# Altium project accessoryidk.PrjPcb
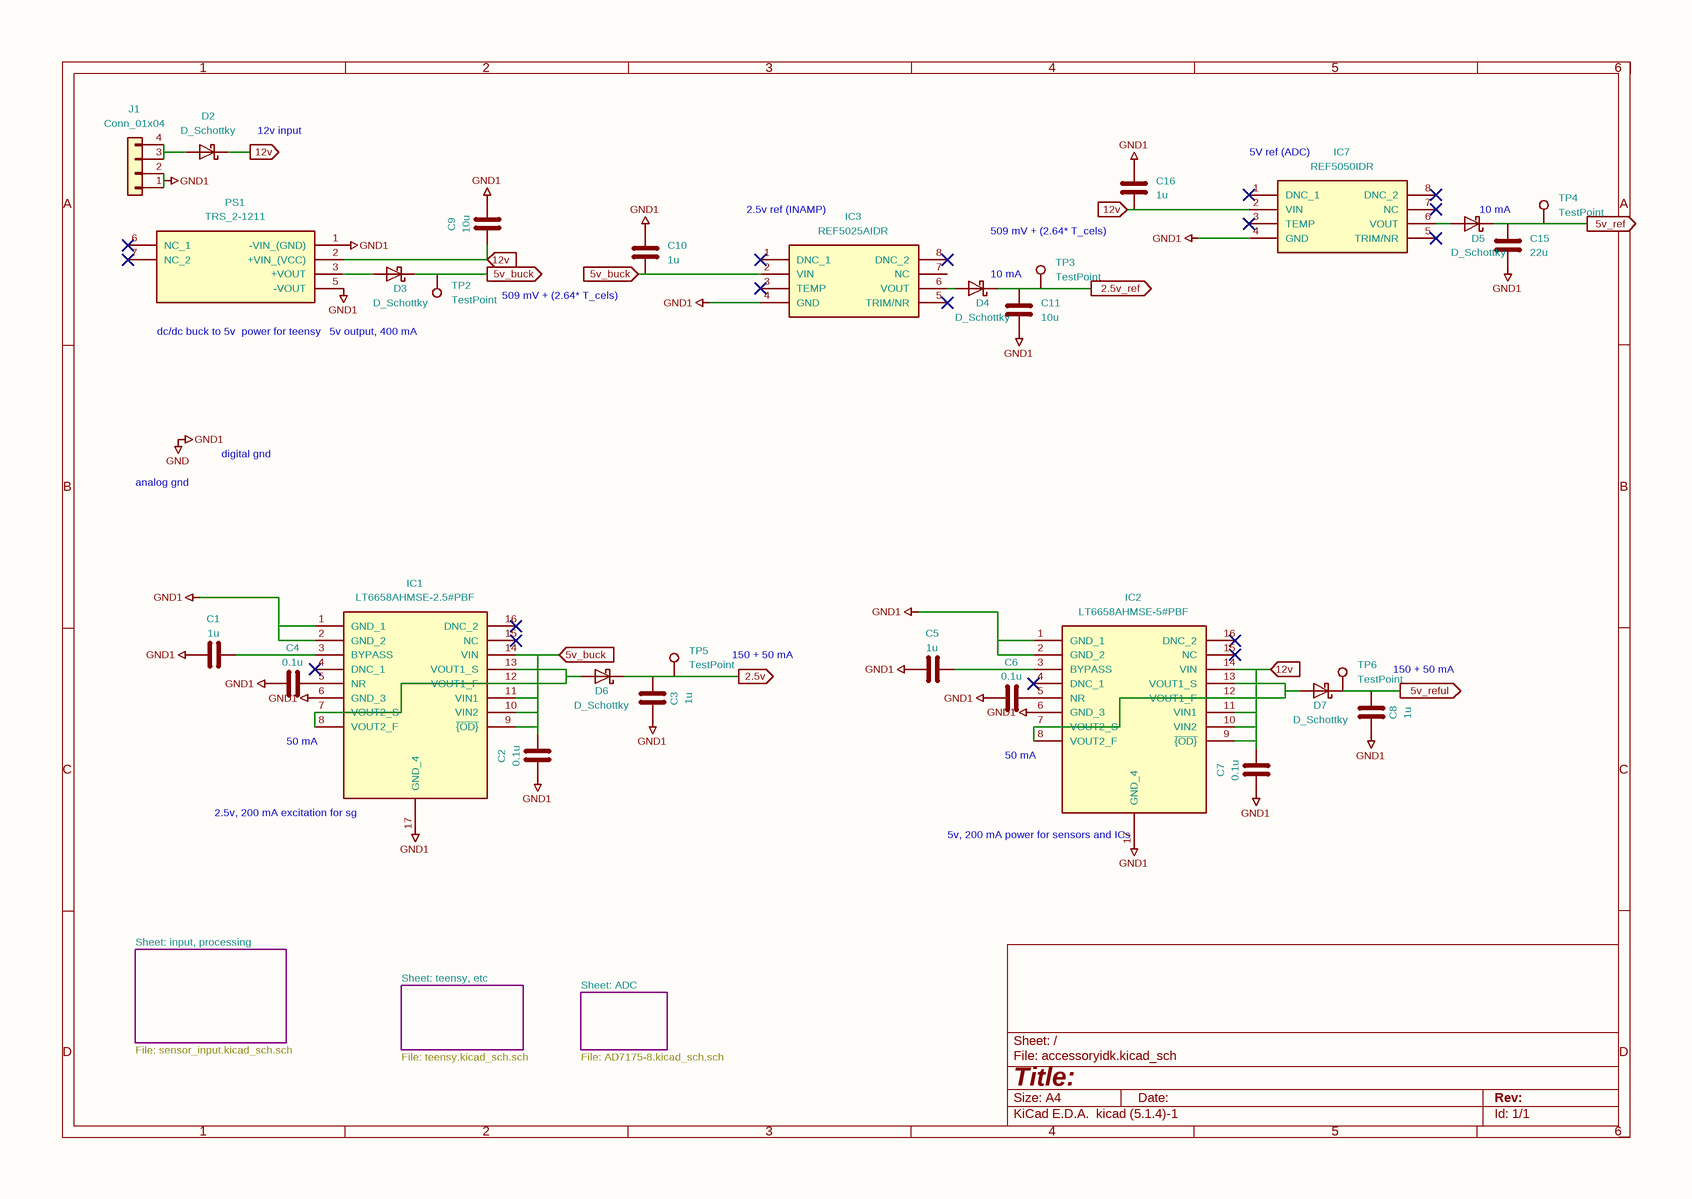
[diagram p0: accessoryidk.SchDoc]
5 sheets, 110 parts. Net scope: flat (ports and power ports of the same name join across sheets).
Board files: accessoryidk.PcbDoc, accessoryidk(1).PcbDoc
Sheets:
  accessoryidk.SchDoc
    teensy, etc = teensy.SchDoc
    input, processing = sensor_input.SchDoc
    ADC = AD7175-8.SchDoc
  untitled.SchDoc

## Sheet accessoryidk.SchDoc
size 297 x 209 mm

### Parts
C1  1u  [C_0603_1608Metric]
C2  0.1u  [C_0603_1608Metric]
C3  1u  [C_0603_1608Metric]
C4  0.1u  [C_0603_1608Metric]
C5  1u  [C_0603_1608Metric]
C6  0.1u  [C_0603_1608Metric]
C7  0.1u  [C_0603_1608Metric]
C8  1u  [C_0603_1608Metric]
C9  10u  [C_1206_3216Metric]
C10  1u  [C_0603_1608Metric]
C11  10u  [C_0603_1608Metric]
C15  22u  [C_0603_1608Metric]
C16  1u  [C_0603_1608Metric]
D2  D_Schottky  [D_1206_3216Metric]
D3  D_Schottky  [D_0603_1608Metric]
D4  D_Schottky  [D_0603_1608Metric]
D5  D_Schottky  [D_0603_1608Metric]
D6  D_Schottky  [D_0603_1608Metric]
D7  D_Schottky  [D_0603_1608Metric]
IC1  LT6658AHMSE-2.5#PBF  [SOP50P490X110-17N]
IC2  LT6658AHMSE-5#PBF  [SOP50P490X110-17N]
IC3  REF5025AIDR  [SOIC127P599X175-8N]
IC7  REF5050IDR  [SOIC127P599X175-8N]
J1  Conn_01x04  [JST_EH_B4B-EH-A_1x04_P2.50mm_Vertical]
PS1  TRS_2-1211  [CONV_TRS_2-2419]
TP2  TestPoint  [TestPoint_Pad_2.0x2.0mm]
TP3  TestPoint  [TestPoint_Pad_2.0x2.0mm]
TP4  TestPoint  [TestPoint_Pad_2.0x2.0mm]
TP5  TestPoint  [TestPoint_Pad_2.0x2.0mm]
TP6  TestPoint  [TestPoint_Pad_2.0x2.0mm]

### Sub-sheets
ADC = AD7175-8.SchDoc: no entries
input, processing = sensor_input.SchDoc: no entries
teensy, etc = teensy.SchDoc: no entries

### Ports
2.5v (out), 2.5v_ref (out), 5v_buck (in), 5v_buck (out), 5v_ref (out), 5v_reful (out), 12v (in), 12v (out)

### Nets
GND: C1.1 C2.1 C3.1 C4.1 C5.1 C6.1 C7.1 C8.1 C9.2 C10.2 C11.2 C15.2 C16.2 IC1.1(GND_1) IC1.2(GND_2) IC1.6(GND_3) IC1.17(GND_4) IC2.1(GND_1) IC2.2(GND_2) IC2.6(GND_3) IC2.17(GND_4) IC3.4(GND) IC7.4(GND) J1.1(Pin_1) J1.2(Pin_2) PS1.1(-VIN_(GND)) PS1.5(-VOUT)  [also labelled GND1]
2.5v: C3.2 D6.1(K) TP5.1 ; port 2.5v
2.5v_ref: C11.1 D4.1(K) TP3.1 ; port 2.5v_ref
5v_buck: C2.2 C10.1 D3.1(K) IC1.9(~{{OD}}) IC1.10(VIN2) IC1.11(VIN1) IC1.14(VIN) IC3.2(VIN) TP2.1 ; port 5v_buck
5v_ref: C15.1 D5.1(K) TP4.1 ; port 5v_ref
5v_reful: C8.2 D7.1(K) TP6.1 ; port 5v_reful
12v: C7.2 C9.1 C16.1 D2.1(K) IC2.9(~{{OD}}) IC2.10(VIN2) IC2.11(VIN1) IC2.14(VIN) IC7.2(VIN) PS1.2(+VIN_(VCC)) ; port 12v
NetC1_2: C1.2 IC1.3(BYPASS)
NetC4_2: C4.2 IC1.5(NR)
NetC5_2: C5.2 IC2.3(BYPASS)
NetC6_2: C6.2 IC2.5(NR)
NetD2_2: D2.2(A) J1.3(Pin_3) J1.4(Pin_4)
NetD3_2: D3.2(A) PS1.3(+VOUT)
NetD4_2: D4.2(A) IC3.6(VOUT)
NetD5_2: D5.2(A) IC7.6(VOUT)
NetD6_2: D6.2(A) IC1.7(VOUT2_S) IC1.8(VOUT2_F) IC1.12(VOUT1_F) IC1.13(VOUT1_S)
NetD7_2: D7.2(A) IC2.7(VOUT2_S) IC2.8(VOUT2_F) IC2.12(VOUT1_F) IC2.13(VOUT1_S)

Not connected (* = marked no-connect by the designer): IC1 4(DNC_1)* 15(NC)* 16(DNC_2)*; IC2 4(DNC_1)* 15(NC)* 16(DNC_2)*; IC3 1(DNC_1)* 3(TEMP)* 5(TRIM/NR)* 7(NC) 8(DNC_2)*; IC7 1(DNC_1)* 3(TEMP)* 5(TRIM/NR)* 7(NC)* 8(DNC_2)*; PS1 6(NC_1)* 7(NC_2)*

### Notes on the sheet
- (near D2) 12v input
- (near IC3) 2.5v ref (INAMP)
- (near IC7) 5V ref (ADC)
- (near D5) 10 mA
- (near D4) 10 mA
- 509 mV + (2.64* T_cels)
- (near PS1) dc/dc buck to 5v
  power for teensy
- 5v output, 400 mA
- analog gnd
- digital gnd
- 150 + 50 mA
- (near IC1) 50 mA
- (near IC2) 50 mA
- (near IC1) 2.5v, 200 mA excitation for sg
- (near IC2) 5v, 200 mA power for sensors and ICs
- Sheet: input, processing
- Sheet: teensy, etc
- Sheet: ADC
- File: sensor_input.kicad_sch.sch
- File: teensy.kicad_sch.sch
- File: AD7175-8.kicad_sch.sch
- 1
- 2
- 3
- 4
- 5
- 6
- A
- B
- C
- D
- Title:
- File: accessoryidk.kicad_sch
- Sheet: /
- KiCad E.D.A.  kicad (5.1.4)-1
- Size: A4
- Date:
- Rev:
- Id: 1/1

### Library data of the parts
C1-C11 C15 C16 = C
  C1 C3 C5 C8 C10 C16: Value: 1u; Footprint: Capacitor_SMD:C_0603_1608Metric
  C2 C4 C6 C7: Value: 0.1u; Footprint: Capacitor_SMD:C_0603_1608Metric
  C9: Value: 10u; Footprint: Capacitor_SMD:C_1206_3216Metric
  C11: Value: 10u; Footprint: Capacitor_SMD:C_0603_1608Metric
  C15: Value: 22u; Footprint: Capacitor_SMD:C_0603_1608Metric
IC1 = LT6658AHMSE-2.5#PBF: Manufacturer_Name: Analog Devices; Height: 1.1; Mouser Part Number: 584-LT6658AHMSE5PBF; Mouser Price/Stock: https://www.mouser.co.uk/ProductDetail/Analog-Devices/LT6658AHMSE-5PBF?qs=W0yvOO0ixfFdSUQ4xUcBUw%3D%3D; Manufacturer_Part_Number: LT6658AHMSE-2.5#PBF; Value: LT6658AHMSE-2.5#PBF; Footprint: 21xt_footprints:SOP50P490X110-17N
IC2 = LT6658AHMSE-5#PBF: Manufacturer_Name: Analog Devices; Height: 1.1; Mouser Part Number: 584-LT6658AHMSE5PBF; Mouser Price/Stock: https://www.mouser.co.uk/ProductDetail/Analog-Devices/LT6658AHMSE-5PBF?qs=W0yvOO0ixfFdSUQ4xUcBUw%3D%3D; Manufacturer_Part_Number: LT6658AHMSE-5#PBF; Value: LT6658AHMSE-5#PBF; Footprint: 21xt_footprints:SOP50P490X110-17N
IC3 IC7 = REF5050IDR: Manufacturer_Name: Texas Instruments; Height: 1.75; Mouser Part Number: 595-REF5050IDR; Mouser Price/Stock: https://www.mouser.co.uk/ProductDetail/Texas-Instruments/REF5050IDR?qs=xL7PkI2RoJ6ioxG%2FxfIGUw%3D%3D; Manufacturer_Part_Number: REF5050IDR; Footprint: 21xt_footprints:SOIC127P599X175-8N
  IC3: Value: REF5025AIDR
  IC7: Value: REF5050IDR
PS1 = TRS_2-1211: Manufacturer_Name: Traco Power; Manufacturer_Part_Number: TRS 2-1211; Height: 8; Mouser Part Number: 495-TRS2-1211; Mouser Price/Stock: https://www.mouser.co.uk/ProductDetail/TRACO-Power/TRS-2-1211?qs=wUXugUrL1qziI%252BEzex2I6g%3D%3D; Value: TRS_2-1211; Footprint: 21xt_footprints:CONV_TRS_2-2419
D2-D7 = D_Schottky: Value: D_Schottky
  D2: Footprint: Diode_SMD:D_1206_3216Metric
  D3-D7: Footprint: Diode_SMD:D_0603_1608Metric
J1 = Conn_01x04: Value: Conn_01x04; Footprint: Connector_JST:JST_EH_B4B-EH-A_1x04_P2.50mm_Vertical
TP2-TP6 = TestPoint: Value: TestPoint; Footprint: TestPoint:TestPoint_Pad_2.0x2.0mm

## Sheet teensy.SchDoc
size 297 x 209 mm
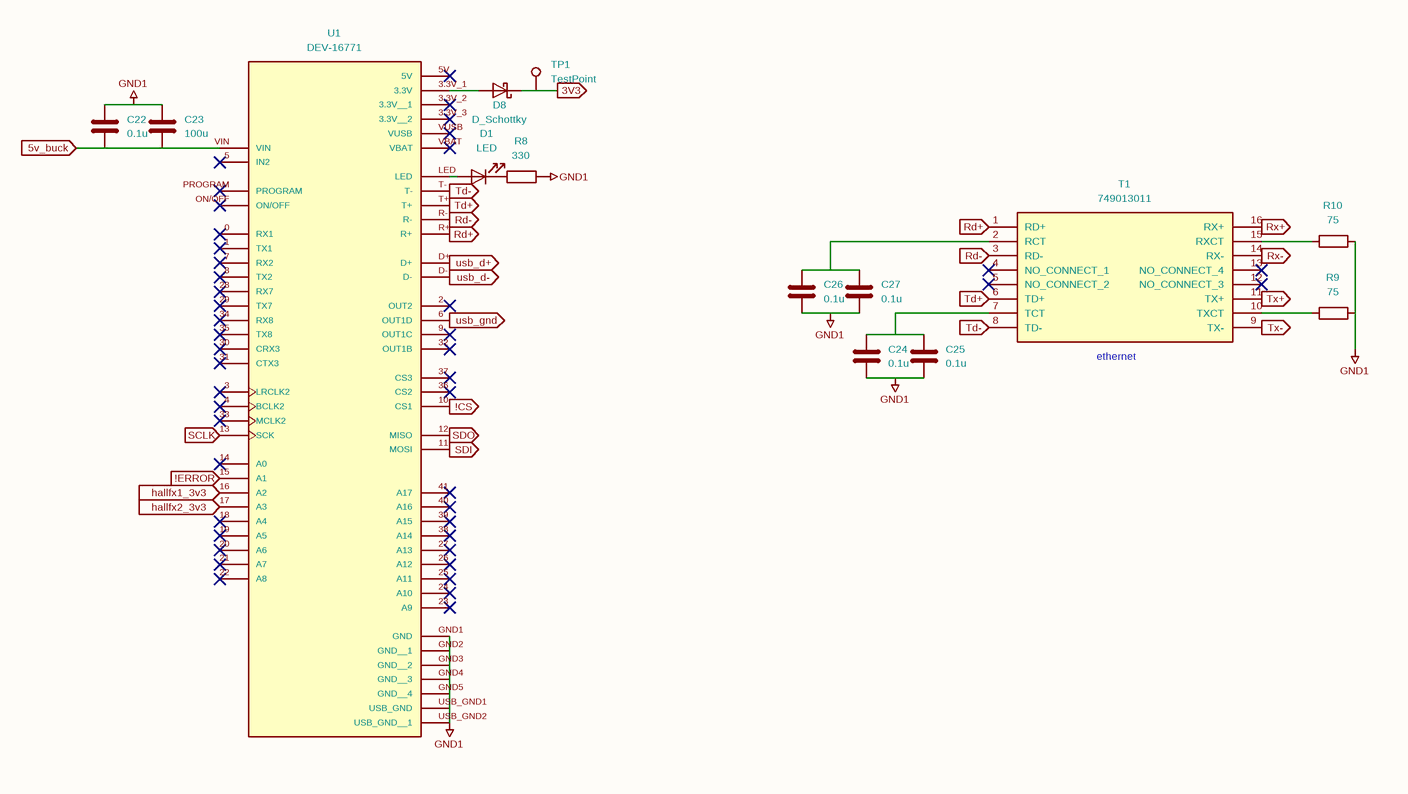
[diagram p1: teensy.SchDoc]

### Parts
(Parts that share a designator on the sheet are numbered #1, #2 ... from top to bottom, then left to right.)
C22#1  0.1u  [C_0603_1608Metric]
C23#1  100u  [C_1206_3216Metric]
C24#1  0.1u  [C_0603_1608Metric]
C25#1  0.1u  [C_0603_1608Metric]
C26#1  0.1u  [C_0603_1608Metric]
C27#1  0.1u  [C_0603_1608Metric]
D1  LED  [D_0603_1608Metric]
D8  D_Schottky  [D_0603_1608Metric]
R8  330  [R_0603_1608Metric]
R9  75  [R_0603_1608Metric]
R10  75  [R_0603_1608Metric]
T1  749013011  [749013011]
TP1  TestPoint  [TestPoint_Pad_2.0x2.0mm]
U1  DEV-16771  [MODULE_DEV-16771]

### Ports
3V3 (out), 5v_buck (in), !CS (out), !ERROR (in), hallfx1_3v3 (in), hallfx2_3v3 (in), Rd+ (in), Rd+ (out), Rd- (in), Rd- (out), Rx+ (in), Rx- (in), SCLK (in), SDI (out), SDO (in), Td+ (in), Td+ (out), Td- (in), Td- (out), Tx+ (in), Tx- (in), usb_d+ (in), usb_d- (in), usb_gnd (in)

### Nets
GND1: C22#1.1 C23#1.1 C24#1.2 C25#1.2 C26#1.2 C27#1.2 R8.2 R9.2 R10.2 U1.6(OUT1D) U1.GND1(GND) U1.GND2(GND__1) U1.GND3(GND__2) U1.GND4(GND__3) U1.GND5(GND__4) U1.USB_GND1(USB_GND) U1.USB_GND2(USB_GND__1) ; port usb_gnd  [project net GND]
3V3: D8.1(K) TP1.1 ; port 3V3
5v_buck: C22#1.2 C23#1.2 U1.VIN ; port 5v_buck
!CS: U1.10(CS1) ; port !CS
!ERROR: U1.15(A1) ; port !ERROR
hallfx1_3v3: U1.16(A2) ; port hallfx1_3v3
hallfx2_3v3: U1.17(A3) ; port hallfx2_3v3
Rd+: T1.1(RD+) U1.R+ ; port Rd+
Rd-: T1.3(RD-) U1.R- ; port Rd-
Rx+: T1.16(RX+) ; port Rx+
Rx-: T1.14(RX-) ; port Rx-
SCLK: U1.13(SCK) ; port SCLK
SDI: U1.11(MOSI) ; port SDI
SDO: U1.12(MISO) ; port SDO
Td+: T1.6(TD+) U1.T+ ; port Td+
Td-: T1.8(TD-) U1.T- ; port Td-
Tx+: T1.11(TX+) ; port Tx+
Tx-: T1.9(TX-) ; port Tx-
usb_d+: U1.D+ ; port usb_d+
usb_d-: U1.D- ; port usb_d-
NetC24#1_1: C24#1.1 C25#1.1 T1.7(TCT)
NetC26#1_1: C26#1.1 C27#1.1 T1.2(RCT)
NetD1_1: D1.1(K) R8.1
NetD1_2: D1.2(A) U1.LED
NetD8_2: D8.2(A) U1.3.3V_1(3.3V)
NetR9_1: R9.1 T1.10(TXCT)
NetR10_1: R10.1 T1.15(RXCT)

Not connected (* = marked no-connect by the designer): T1 4(NO_CONNECT_1)* 5(NO_CONNECT_2)* 12(NO_CONNECT_3)* 13(NO_CONNECT_4)*; U1 0(RX1)* 1(TX1)* 2(OUT2)* 3(LRCLK2)* 3.3V_2(3.3V__1)* 3.3V_3(3.3V__2)* 4(BCLK2)* 5(IN2)* 5V* 7(RX2)* 8(TX2)* 9(OUT1C)* 14(A0)* 18(A4)* 19(A5)* 20(A6)* 21(A7)* 22(A8)* 23(A9)* 24(A10)* 25(A11)* 26(A12)* 27(A13)* 28(RX7)* 29(TX7)* 30(CRX3)* 31(CTX3)* 32(OUT1B)* 33(MCLK2)* 34(RX8)* 35(TX8)* 36(CS2)* 37(CS3)* 38(A14)* 39(A15)* 40(A16)* 41(A17)* ON/OFF* PROGRAM* VBAT* VUSB*

### Notes on the sheet
- (near T1) ethernet
- 1
- 2
- 3
- 4
- 5
- 6
- A
- B
- C
- D
- Title:
- File: teensy.kicad_sch
- Sheet: /
- KiCad E.D.A.  kicad (5.1.4)-1
- Size: A4
- Date:
- Rev:
- Id: 1/1

### Library data of the parts
C22#1 C23#1 C24#1 C25#1 C26#1 C27#1 = C
  C22#1 C24#1 C25#1 C26#1 C27#1: Value: 0.1u; Footprint: Capacitor_SMD:C_0603_1608Metric
  C23#1: Value: 100u; Footprint: Capacitor_SMD:C_1206_3216Metric
R8-R10 = R: Footprint: Resistor_SMD:R_0603_1608Metric
  R8: Value: 330
  R9 R10: Value: 75
T1 = 749013011: Manufacturer_Name: Wurth Elektronik; Height: 5.33; Mouser Part Number: 710-749013011; Mouser Price/Stock: https://www.mouser.co.uk/ProductDetail/Wurth-Elektronik/749013011?qs=2sV1BwmkawRYxGj1O9AWzA%3D%3D; Manufacturer_Part_Number: 749013011; Value: 749013011; Footprint: 21xt_footprints:749013011
U1 = DEV-16771: MANUFACTURER: SparkFun Electronics; PARTREV: 4.1; MAXIMUM_PACKAGE_HEIGHT: 4.07mm; STANDARD: Manufacturer recommendations; Value: DEV-16771; Footprint: 21xt_footprints:MODULE_DEV-16771
D1 = LED: Value: LED; Footprint: Diode_SMD:D_0603_1608Metric
D8 = D_Schottky: Value: D_Schottky; Footprint: Diode_SMD:D_0603_1608Metric
TP1 = TestPoint: Value: TestPoint; Footprint: TestPoint:TestPoint_Pad_2.0x2.0mm

## Sheet sensor_input.SchDoc
size 297 x 209 mm
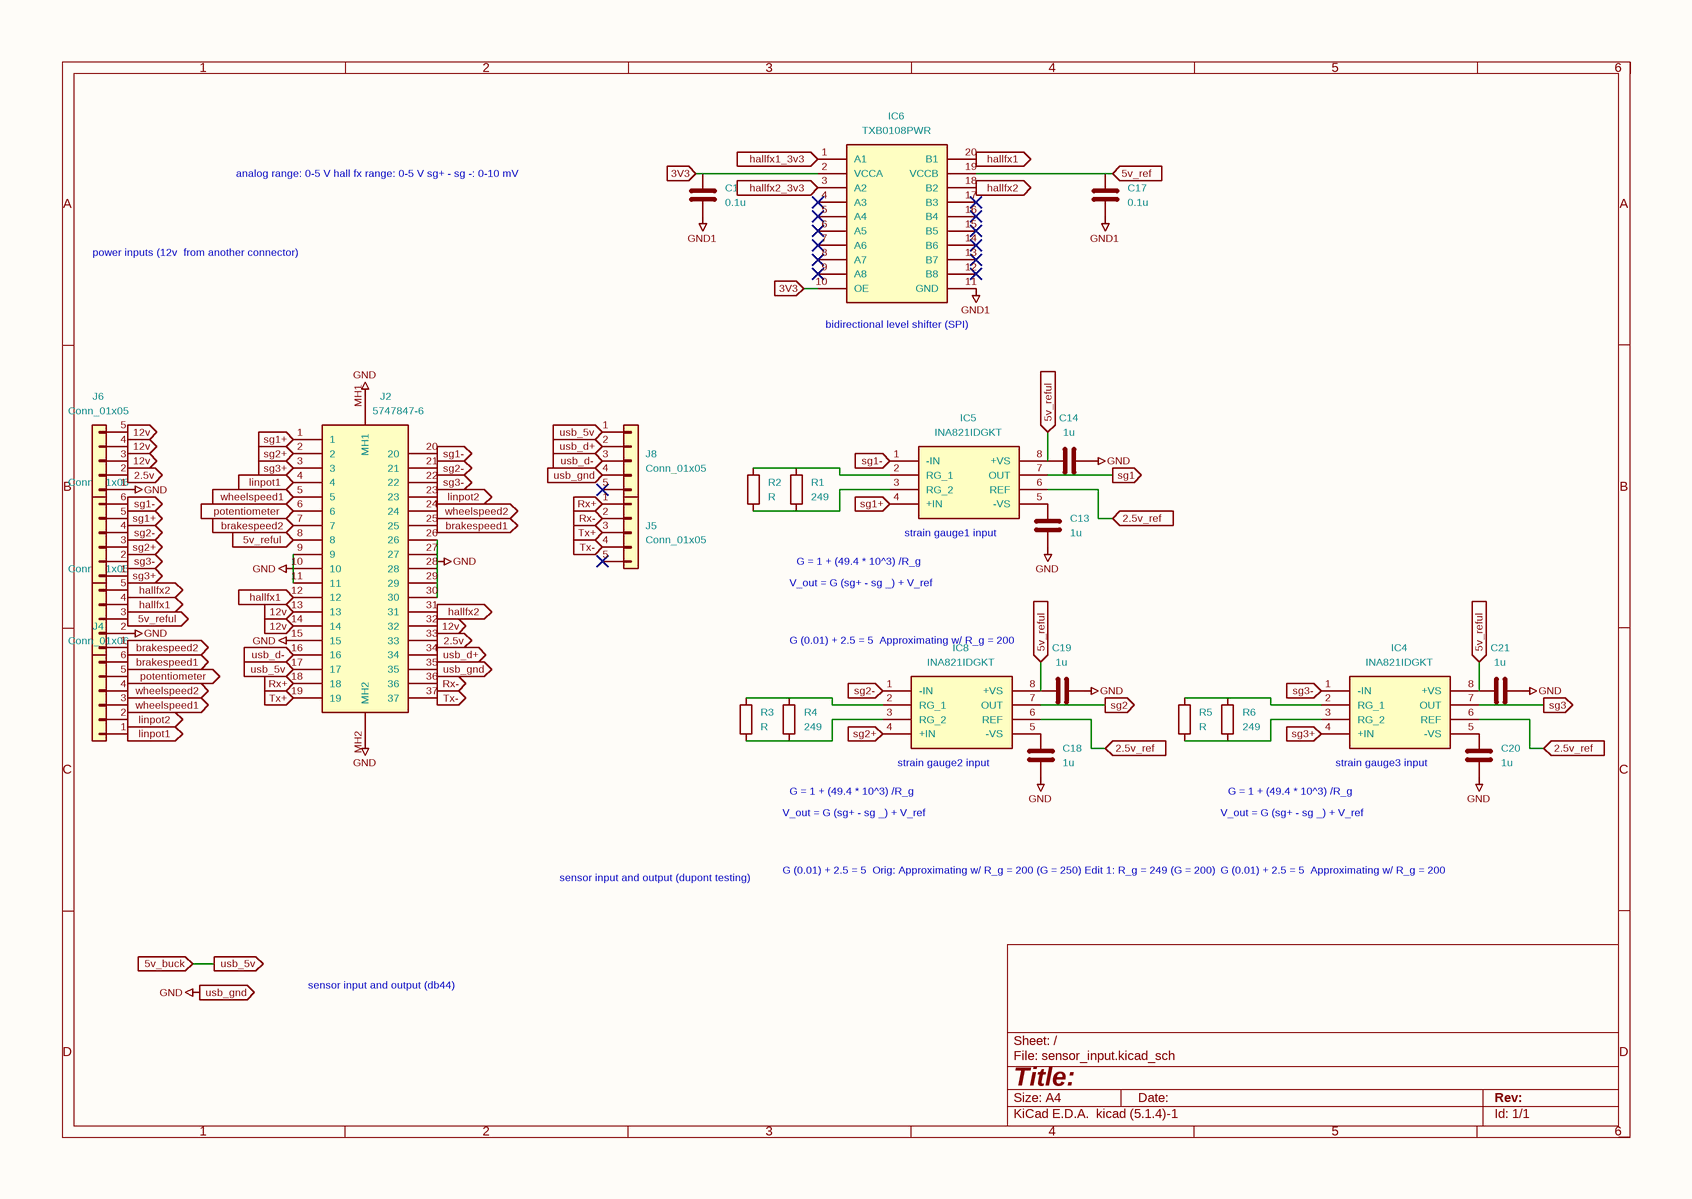
[diagram p2: sensor_input.SchDoc]

### Parts
(Parts that share a designator on the sheet are numbered #1, #2 ... from top to bottom, then left to right.)
C12#1  0.1u  [C_0603_1608Metric]
C13#1  1u  [C_0603_1608Metric]
C14#1  1u  [C_0603_1608Metric]
C17#1  0.1u  [C_0603_1608Metric]
C18#1  1u  [C_0603_1608Metric]
C19#1  1u  [C_0603_1608Metric]
C20#1  1u  [C_0603_1608Metric]
C21#1  1u  [C_0603_1608Metric]
IC4#1  INA821IDGKT  [SOP65P490X110-8N]
IC5#1  INA821IDGKT  [SOP65P490X110-8N]
IC6#1  TXB0108PWR  [SOP65P640X120-20N]
IC8#1  INA821IDGKT  [SOP65P490X110-8N]
J2#1  5747847-6  [57478476]
J3  Conn_01x05  [JST_EH_B5B-EH-A_1x05_P2.50mm_Vertical]
J4  Conn_01x06  [JST_EH_B6B-EH-A_1x06_P2.50mm_Vertical]
J5  Conn_01x05  [JST_EH_B5B-EH-A_1x05_P2.50mm_Vertical]
J6  Conn_01x05  [JST_EH_B5B-EH-A_1x05_P2.50mm_Vertical]
J7  Conn_01x06  [JST_EH_B6B-EH-A_1x06_P2.50mm_Vertical]
J8  Conn_01x05  [JST_EH_B5B-EH-A_1x05_P2.50mm_Vertical]
R1#1  249  [R_0603_1608Metric]
R2#1  R  [R_0603_1608Metric]
R3#1  R  [R_0603_1608Metric]
R4#1  249  [R_0603_1608Metric]
R5#1  R  [R_0603_1608Metric]
R6#1  249  [R_0603_1608Metric]

### Ports
2.5v (in), 2.5v_ref (in), 3V3 (in), 5v_buck (in), 5v_ref (in), 5v_reful (in), 12v (in), brakespeed1 (in), brakespeed1 (out), brakespeed2 (in), brakespeed2 (out), hallfx1 (in), hallfx1 (out), hallfx1_3v3 (out), hallfx2 (in), hallfx2 (out), hallfx2_3v3 (out), linpot1 (in), linpot1 (out), linpot2 (in), linpot2 (out), potentiometer (in), potentiometer (out), Rx+ (in), Rx+ (out), Rx- (in), Rx- (out), sg1 (out), sg1+ (in), sg1+ (out), sg1- (in), sg1- (out), sg2 (out), sg2+ (in), sg2+ (out), sg2- (in), sg2- (out), sg3 (out), sg3+ (in), sg3+ (out), sg3- (in), sg3- (out), Tx+ (in), Tx+ (out), Tx- (in), Tx- (out), usb_5v (in), usb_5v (out), usb_d+ (in), usb_d+ (out), usb_d- (in), usb_d- (out), usb_gnd (in), usb_gnd (out), wheelspeed1 (in), wheelspeed1 (out), wheelspeed2 (in), wheelspeed2 (out)

### Nets
GND: C12#1.2 C13#1.2 C14#1.2 C17#1.2 C18#1.2 C19#1.2 C20#1.2 C21#1.2 IC6#1.11(GND) J2#1.9 J2#1.10 J2#1.11 J2#1.15 J2#1.26 J2#1.27 J2#1.28 J2#1.29 J2#1.30 J2#1.35 J2#1.MH1 J2#1.MH2 J3.2(Pin_2) J6.1(Pin_1) J8.4(Pin_4) ; port usb_gnd  [also labelled GND1]
2.5v: J2#1.33 J6.2(Pin_2) ; port 2.5v
2.5v_ref: IC4#1.6(REF) IC5#1.6(REF) IC8#1.6(REF) ; port 2.5v_ref
3V3: C12#1.1 IC6#1.2(VCCA) IC6#1.10(OE) ; port 3V3
5v_buck: J2#1.17 J8.1(Pin_1) ; port usb_5v, port 5v_buck
5v_ref: C17#1.1 IC6#1.19(VCCB) ; port 5v_ref
5v_reful: C14#1.1 C19#1.1 C21#1.1 IC4#1.8(+VS) IC5#1.8(+VS) IC8#1.8(+VS) J2#1.8 J3.3(Pin_3) ; port 5v_reful
12v: J2#1.13 J2#1.14 J2#1.32 J6.3(Pin_3) J6.4(Pin_4) J6.5(Pin_5) ; port 12v
brakespeed1: J2#1.25 J4.6(Pin_6) ; port brakespeed1
brakespeed2: J2#1.7 J3.1(Pin_1) ; port brakespeed2
hallfx1: IC6#1.20(B1) J2#1.12 J3.4(Pin_4) ; port hallfx1
hallfx1_3v3: IC6#1.1(A1) ; port hallfx1_3v3
hallfx2: IC6#1.18(B2) J2#1.31 J3.5(Pin_5) ; port hallfx2
hallfx2_3v3: IC6#1.3(A2) ; port hallfx2_3v3
linpot1: J2#1.4 J4.1(Pin_1) ; port linpot1
linpot2: J2#1.23 J4.2(Pin_2) ; port linpot2
potentiometer: J2#1.6 J4.5(Pin_5) ; port potentiometer
Rx+: J2#1.18 J5.1(Pin_1) ; port Rx+
Rx-: J2#1.36 J5.2(Pin_2) ; port Rx-
sg1: IC5#1.7(OUT) ; port sg1
sg1+: IC5#1.4(+IN) J2#1.1 J7.5(Pin_5) ; port sg1+
sg1-: IC5#1.1(-IN) J2#1.20 J7.6(Pin_6) ; port sg1-
sg2: IC8#1.7(OUT) ; port sg2
sg2+: IC8#1.4(+IN) J2#1.2 J7.3(Pin_3) ; port sg2+
sg2-: IC8#1.1(-IN) J2#1.21 J7.4(Pin_4) ; port sg2-
sg3: IC4#1.7(OUT) ; port sg3
sg3+: IC4#1.4(+IN) J2#1.3 J7.1(Pin_1) ; port sg3+
sg3-: IC4#1.1(-IN) J2#1.22 J7.2(Pin_2) ; port sg3-
Tx+: J2#1.19 J5.3(Pin_3) ; port Tx+
Tx-: J2#1.37 J5.4(Pin_4) ; port Tx-
usb_d+: J2#1.34 J8.2(Pin_2) ; port usb_d+
usb_d-: J2#1.16 J8.3(Pin_3) ; port usb_d-
wheelspeed1: J2#1.5 J4.3(Pin_3) ; port wheelspeed1
wheelspeed2: J2#1.24 J4.4(Pin_4) ; port wheelspeed2
NetC13#1_1: C13#1.1 IC5#1.5(-VS)
NetC18#1_1: C18#1.1 IC8#1.5(-VS)
NetC20#1_1: C20#1.1 IC4#1.5(-VS)
NetIC4#1_2: IC4#1.2(RG_1) R5#1.1 R6#1.1
NetIC4#1_3: IC4#1.3(RG_2) R5#1.2 R6#1.2
NetIC5#1_2: IC5#1.2(RG_1) R1#1.1 R2#1.1
NetIC5#1_3: IC5#1.3(RG_2) R1#1.2 R2#1.2
NetIC8#1_2: IC8#1.2(RG_1) R3#1.1 R4#1.1
NetIC8#1_3: IC8#1.3(RG_2) R3#1.2 R4#1.2

Not connected (* = marked no-connect by the designer): IC6#1 4(A3)* 5(A4)* 6(A5)* 7(A6)* 8(A7)* 9(A8)* 12(B8)* 13(B7)* 14(B6)* 15(B5)* 16(B4)* 17(B3)*; J5 5(Pin_5)*; J8 5(Pin_5)*

### Notes on the sheet
- analog range: 0-5 V
  hall fx range: 0-5 V
  sg+ - sg -: 0-10 mV
- power inputs (12v
  from another connector)
- (near IC6#1) bidirectional level shifter (SPI)
- G = 1 + (49.4 * 10^3) /R_g
- (near IC5#1) strain gauge1 input
- V_out = G (sg+ - sg _) + V_ref
- G (0.01) + 2.5 = 5
  Approximating w/ R_g = 200
- (near IC8#1) strain gauge2 input
- (near IC4#1) strain gauge3 input
- sensor input and output
  (dupont testing)
- G (0.01) + 2.5 = 5
  Orig: Approximating w/ R_g = 200 (G = 250)
  Edit 1: R_g = 249 (G = 200)
- sensor input and output
  (db44)
- 1
- 2
- 3
- 4
- 5
- 6
- A
- B
- C
- D
- Title:
- File: sensor_input.kicad_sch
- Sheet: /
- KiCad E.D.A.  kicad (5.1.4)-1
- Size: A4
- Date:
- Rev:
- Id: 1/1

### Library data of the parts
C12#1 C13#1 C14#1 C17#1 C18#1 C19#1 C20#1 C21#1 = C: Footprint: Capacitor_SMD:C_0603_1608Metric
  C12#1 C17#1: Value: 0.1u
  C13#1 C14#1 C18#1 C19#1 C20#1 C21#1: Value: 1u
IC4#1 IC5#1 IC8#1 = INA821IDGKT: Manufacturer_Name: Texas Instruments; Height: 1.1; Mouser Part Number: 595-INA821IDGKT; Mouser Price/Stock: https://www.mouser.co.uk/ProductDetail/Texas-Instruments/INA821IDGKT?qs=LDGDZb5k%2F%252B8diOW5CeiHfQ%3D%3D; Manufacturer_Part_Number: INA821IDGKT; Value: INA821IDGKT; Footprint: 21xt_footprints:SOP65P490X110-8N
IC6#1 = TXB0108PWR: Manufacturer_Name: Texas Instruments; Height: 1.2; Mouser Part Number: 595-TXB0108PWR; Mouser Price/Stock: https://www.mouser.co.uk/ProductDetail/Texas-Instruments/TXB0108PWR?qs=oFXvjAmG9EgEUWGWzOVFCA%3D%3D; Manufacturer_Part_Number: TXB0108PWR; Value: TXB0108PWR; Footprint: 21xt_footprints:SOP65P640X120-20N
J2#1 = 5747847-6: Manufacturer_Name: TE Connectivity; Height: 12.9286; Manufacturer_Part_Number: 5747847-6; Mouser Part Number: 571-5747847-6; Mouser Price/Stock: https://www.mouser.co.uk/ProductDetail/TE-Connectivity/5747847-6?qs=DUjmvCJSYRDRvMVFkAFvlQ%3D%3D; Arrow Part Number: 5747847-6; Arrow Price/Stock: https://www.arrow.com/en/products/5747847-6/te-connectivity?region=nac; Value: 5747847-6; Footprint: 21xt_footprints:57478476
R1#1 R4#1 R6#1 = R: Value: 249; Footprint: Resistor_SMD:R_0603_1608Metric
J3 J5 J6 J8 = Conn_01x05: Value: Conn_01x05; Footprint: Connector_JST:JST_EH_B5B-EH-A_1x05_P2.50mm_Vertical
J4 J7 = Conn_01x06: Value: Conn_01x06; Footprint: Connector_JST:JST_EH_B6B-EH-A_1x06_P2.50mm_Vertical
R2#1 R3#1 R5#1 = R: Value: R; Footprint: Resistor_SMD:R_0603_1608Metric

## Sheet AD7175-8.SchDoc
size 297 x 209 mm
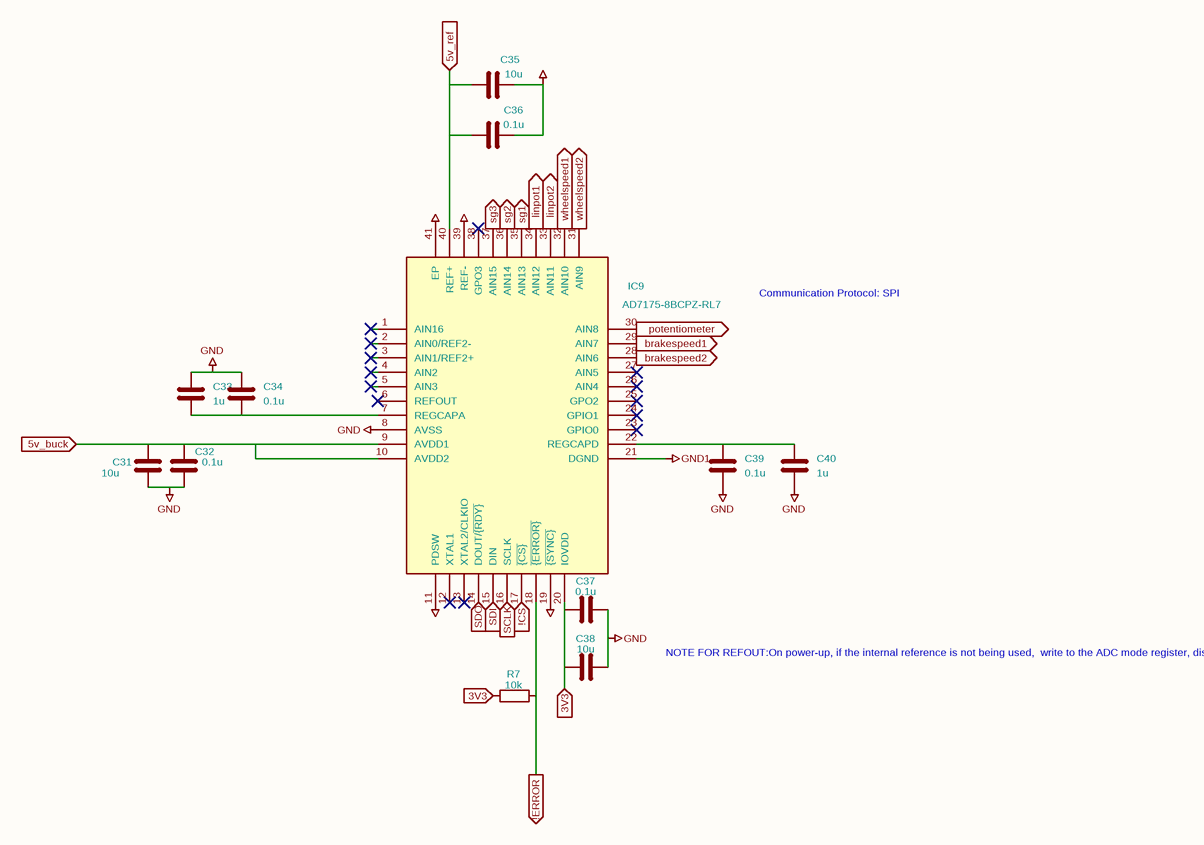
[diagram p3: AD7175-8.SchDoc]

### Parts
(Parts that share a designator on the sheet are numbered #1, #2 ... from top to bottom, then left to right.)
C31  10u  [C_0603_1608Metric]
C32  0.1u  [C_0603_1608Metric]
C33  1u  [C_0603_1608Metric]
C34  0.1u  [C_0603_1608Metric]
C35  10u  [C_0603_1608Metric]
C36  0.1u  [C_0603_1608Metric]
C37  0.1u  [C_0603_1608Metric]
C38  10u  [C_0603_1608Metric]
C39  0.1u  [C_0603_1608Metric]
C40  1u  [C_0603_1608Metric]
IC9#1  AD7175-8BCPZ-RL7  [QFN50P600X600X80-41N]
R7  10k  [R_0603_1608Metric]

### Ports
3V3 (in), 5v_buck (in), 5v_ref (in), !CS (in), !ERROR (out), brakespeed1 (in), brakespeed2 (in), linpot1 (in), linpot2 (in), potentiometer (in), SCLK (in), SDI (in), SDO (out), sg1 (in), sg2 (in), sg3 (in), wheelspeed1 (in), wheelspeed2 (in)

### Nets
GND: C31.2 C32.2 C33.1 C34.1 C35.2 C36.2 C37.2 C38.2 C39.2 C40.2 IC9#1.8(AVSS) IC9#1.11(PDSW) IC9#1.19(~{{SYNC}}) IC9#1.21(DGND) IC9#1.39(REF-) IC9#1.41(EP)  [also labelled GND1]
3V3: C37.1 C38.1 IC9#1.20(IOVDD) R7.1 ; port 3V3
5v_buck: C31.1 C32.1 IC9#1.9(AVDD1) IC9#1.10(AVDD2) ; port 5v_buck
5v_ref: C35.1 C36.1 IC9#1.40(REF+) ; port 5v_ref
!CS: IC9#1.17(~{{CS}}) ; port !CS
!ERROR: IC9#1.18(~{{ERROR}}) R7.2 ; port !ERROR
brakespeed1: IC9#1.29(AIN7) ; port brakespeed1
brakespeed2: IC9#1.28(AIN6) ; port brakespeed2
linpot1: IC9#1.34(AIN12) ; port linpot1
linpot2: IC9#1.33(AIN11) ; port linpot2
potentiometer: IC9#1.30(AIN8) ; port potentiometer
SCLK: IC9#1.16(SCLK) ; port SCLK
SDI: IC9#1.15(DIN) ; port SDI
SDO: IC9#1.14(DOUT/~{{RDY}}) ; port SDO
sg1: IC9#1.35(AIN13) ; port sg1
sg2: IC9#1.36(AIN14) ; port sg2
sg3: IC9#1.37(AIN15) ; port sg3
wheelspeed1: IC9#1.32(AIN10) ; port wheelspeed1
wheelspeed2: IC9#1.31(AIN9) ; port wheelspeed2
NetC33_2: C33.2 C34.2 IC9#1.7(REGCAPA)
NetC39_1: C39.1 C40.1 IC9#1.22(REGCAPD)

Not connected (* = marked no-connect by the designer): IC9#1 1(AIN16)* 2(AIN0/REF2-)* 3(AIN1/REF2+)* 4(AIN2)* 5(AIN3)* 6(REFOUT)* 12(XTAL1)* 13(XTAL2/CLKIO)* 23(GPIO0)* 24(GPIO1)* 25(GPO2)* 26(AIN4)* 27(AIN5)* 38(GPO3)*

### Notes on the sheet
- Communication Protocol: SPI
- NOTE FOR REFOUT:On power-up, if the internal reference is not being used,
  write to the ADC mode register, disabling the internal reference.
  This is controlled by the REF_EN bit (Bit 15) in the ADC mode register
- 1
- 2
- 3
- 4
- 5
- 6
- A
- B
- C
- D
- Title:
- File: AD7175-8.kicad_sch
- Sheet: /
- KiCad E.D.A.  kicad (5.1.4)-1
- Size: A4
- Date:
- Rev:
- Id: 1/1

### Library data of the parts
C31-C40 = C: Footprint: Capacitor_SMD:C_0603_1608Metric
  C31 C35 C38: Value: 10u
  C32 C34 C36 C37 C39: Value: 0.1u
  C33 C40: Value: 1u
IC9#1 = AD7175-8BCPZ-RL7: Manufacturer_Name: Analog Devices; Height: 0.8; Mouser Part Number: 584-AD7175-8BCPZ-RL7; Mouser Price/Stock: https://www.mouser.co.uk/ProductDetail/Analog-Devices/AD7175-8BCPZ-RL7?qs=JeIcUl65ClCxXjl02vXI6Q%3D%3D; Manufacturer_Part_Number: AD7175-8BCPZ-RL7; Value: AD7175-8BCPZ-RL7; Footprint: 21xt_footprints:QFN50P600X600X80-41N
R7 = R: Value: 10k; Footprint: Resistor_SMD:R_0603_1608Metric

## Sheet untitled.SchDoc
size 297 x 209 mm
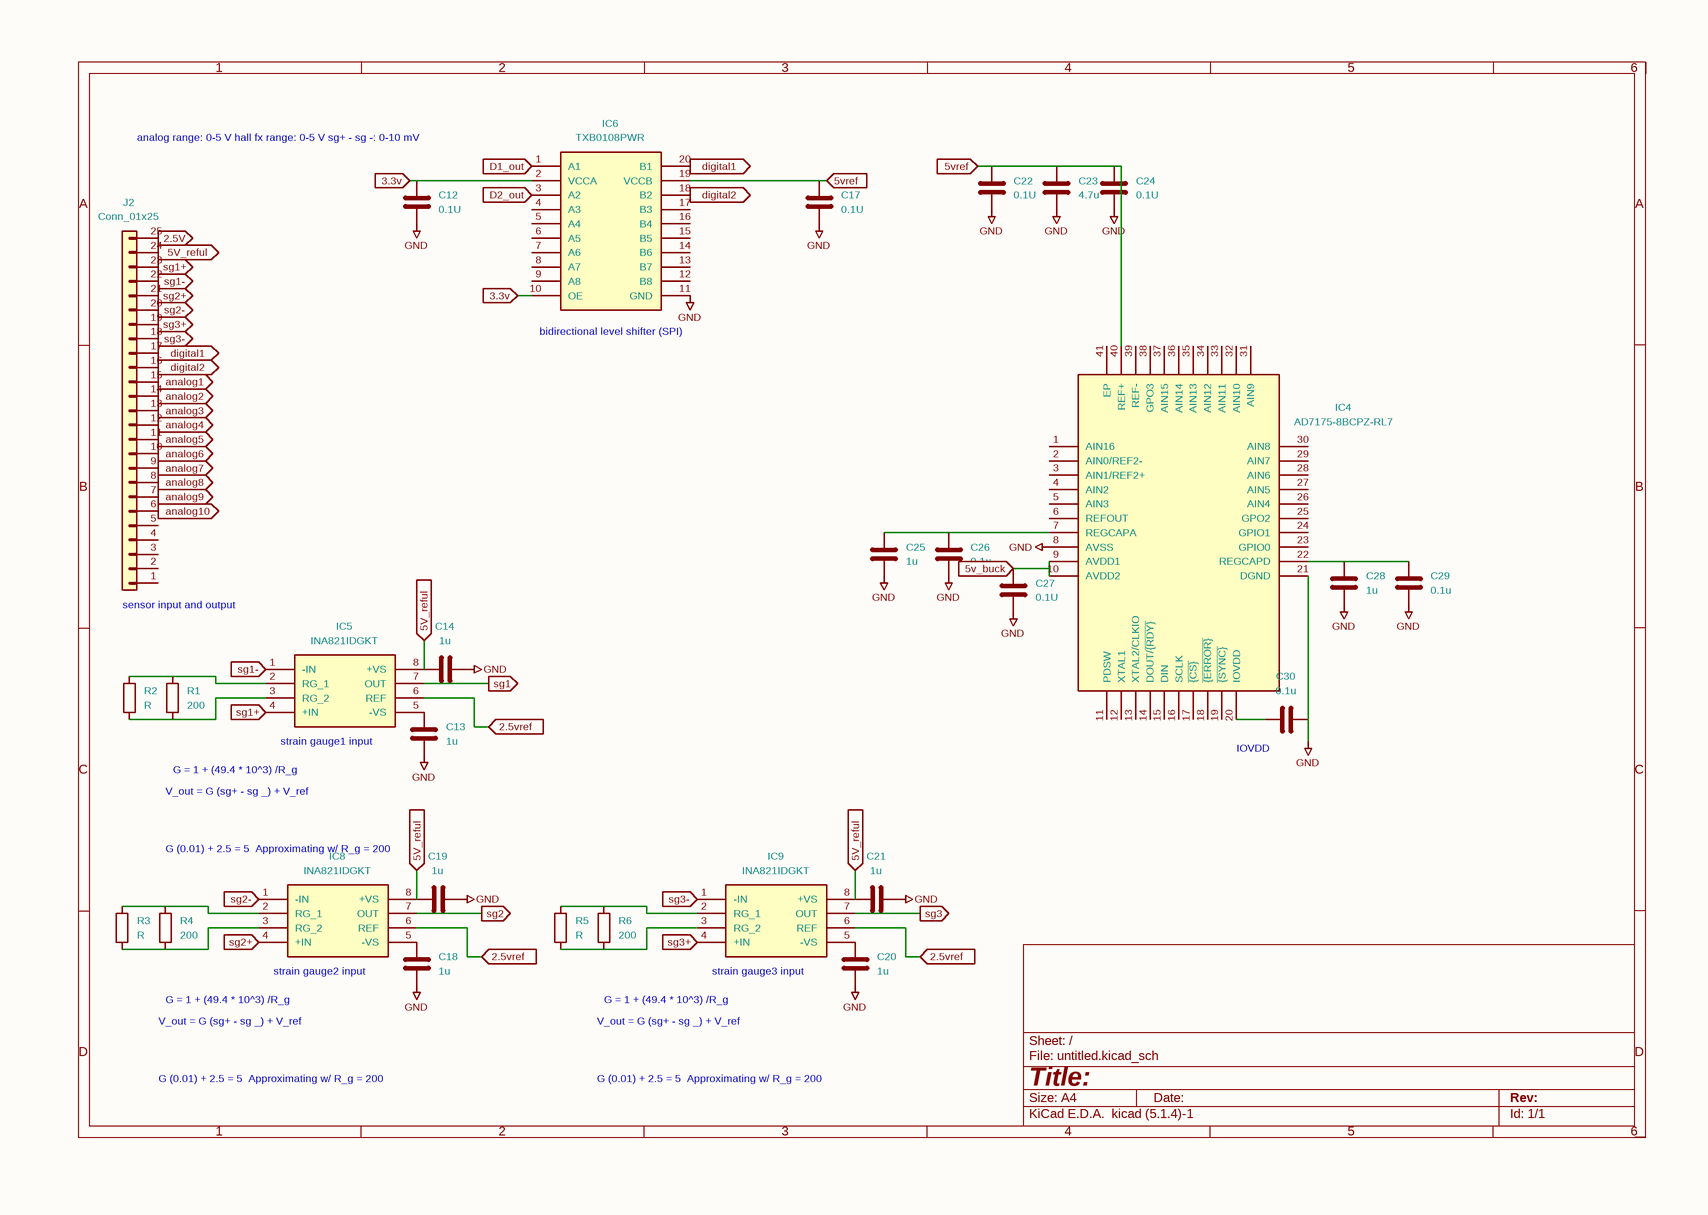
[diagram p4: untitled.SchDoc]

### Parts
(Parts that share a designator on the sheet are numbered #1, #2 ... from top to bottom, then left to right.)
C12#2  0.1U
C13#2  1u
C14#2  1u
C17#2  0.1U
C18#2  1u
C19#2  1u
C20#2  1u
C21#2  1u
C22#2  0.1U
C23#2  4.7u
C24#2  0.1U
C25#2  1u
C26#2  0.1u
C27#2  0.1U
C28  1u
C29  0.1u
C30  0.1u
IC4#2  AD7175-8BCPZ-RL7  [QFN50P600X600X80-41N-D]
IC5#2  INA821IDGKT  [SOP65P490X110-8N]
IC6#2  TXB0108PWR  [SOP65P640X120-20N]
IC8#2  INA821IDGKT  [SOP65P490X110-8N]
IC9#2  INA821IDGKT  [SOP65P490X110-8N]
J2#2  Conn_01x25
R1#2  200
R2#2  R
R3#2  R
R4#2  200
R5#2  R
R6#2  200

### Ports
2.5V (in), 2.5vref (in), 3.3v (in), 5v_buck (in), 5V_reful (in), 5vref (in), analog1 (out), analog2 (out), analog3 (out), analog4 (out), analog5 (out), analog6 (out), analog7 (out), analog8 (out), analog9 (out), analog10 (out), D1_out (out), D2_out (out), digital1 (in), digital1 (out), digital2 (in), digital2 (out), sg1 (out), sg1+ (in), sg1+ (out), sg1- (in), sg1- (out), sg2 (out), sg2+ (in), sg2+ (out), sg2- (in), sg2- (out), sg3 (out), sg3+ (in), sg3+ (out), sg3- (in), sg3- (out)

### Nets
GND: C12#2.2 C13#2.2 C14#2.2 C17#2.2 C18#2.2 C19#2.2 C20#2.2 C21#2.2 C22#2.2 C23#2.2 C24#2.2 C25#2.2 C26#2.2 C27#2.2 C28.2 C29.2 C30.2 IC4#2.8(AVSS) IC4#2.21(DGND) IC6#2.11(GND)
2.5v: J2#2.25(Pin_25) ; port 2.5V
2.5vref: IC5#2.6(REF) IC8#2.6(REF) IC9#2.6(REF) ; port 2.5vref
3.3v: C12#2.1 IC6#2.2(VCCA) IC6#2.10(OE) ; port 3.3v
5v_buck: C27#2.1 IC4#2.9(AVDD1) IC4#2.10(AVDD2) ; port 5v_buck
5v_reful: C14#2.1 C19#2.1 C21#2.1 IC5#2.8(+VS) IC8#2.8(+VS) IC9#2.8(+VS) J2#2.24(Pin_24) ; port 5V_reful
5vref: C17#2.1 C22#2.1 C23#2.1 C24#2.1 IC4#2.40(REF+) IC6#2.19(VCCB) ; port 5vref
analog1: J2#2.15(Pin_15) ; port analog1
analog2: J2#2.14(Pin_14) ; port analog2
analog3: J2#2.13(Pin_13) ; port analog3
analog4: J2#2.12(Pin_12) ; port analog4
analog5: J2#2.11(Pin_11) ; port analog5
analog6: J2#2.10(Pin_10) ; port analog6
analog7: J2#2.9(Pin_9) ; port analog7
analog8: J2#2.8(Pin_8) ; port analog8
analog9: J2#2.7(Pin_7) ; port analog9
analog10: J2#2.6(Pin_6) ; port analog10
D1_out: IC6#2.1(A1) ; port D1_out
D2_out: IC6#2.3(A2) ; port D2_out
digital1: IC6#2.20(B1) J2#2.17(Pin_17) ; port digital1
digital2: IC6#2.18(B2) J2#2.16(Pin_16) ; port digital2
sg1: IC5#2.7(OUT) ; port sg1
sg1+: IC5#2.4(+IN) J2#2.23(Pin_23) ; port sg1+
sg1-: IC5#2.1(-IN) J2#2.22(Pin_22) ; port sg1-
sg2: IC8#2.7(OUT) ; port sg2
sg2+: IC8#2.4(+IN) J2#2.21(Pin_21) ; port sg2+
sg2-: IC8#2.1(-IN) J2#2.20(Pin_20) ; port sg2-
sg3: IC9#2.7(OUT) ; port sg3
sg3+: IC9#2.4(+IN) J2#2.19(Pin_19) ; port sg3+
sg3-: IC9#2.1(-IN) J2#2.18(Pin_18) ; port sg3-
NetC13#2_1: C13#2.1 IC5#2.5(-VS)
NetC18#2_1: C18#2.1 IC8#2.5(-VS)
NetC20#2_1: C20#2.1 IC9#2.5(-VS)
NetC25#2_1: C25#2.1 C26#2.1 IC4#2.7(REGCAPA)
NetC28_1: C28.1 C29.1 IC4#2.22(REGCAPD)
NetC30_1: C30.1 IC4#2.20(IOVDD)
NetIC5#2_2: IC5#2.2(RG_1) R1#2.1 R2#2.1
NetIC5#2_3: IC5#2.3(RG_2) R1#2.2 R2#2.2
NetIC8#2_2: IC8#2.2(RG_1) R3#2.1 R4#2.1
NetIC8#2_3: IC8#2.3(RG_2) R3#2.2 R4#2.2
NetIC9#2_2: IC9#2.2(RG_1) R5#2.1 R6#2.1
NetIC9#2_3: IC9#2.3(RG_2) R5#2.2 R6#2.2

Not connected (* = marked no-connect by the designer): IC4#2 1(AIN16) 2(AIN0/REF2-) 3(AIN1/REF2+) 4(AIN2) 5(AIN3) 6(REFOUT) 11(PDSW) 12(XTAL1) 13(XTAL2/CLKIO) 14(DOUT/~{{RDY}}) 15(DIN) 16(SCLK) 17(~{{CS}}) 18(~{{ERROR}}) 19(~{{SYNC}}) 23(GPIO0) 24(GPIO1) 25(GPO2) 26(AIN4) 27(AIN5) 28(AIN6) 29(AIN7) 30(AIN8) 31(AIN9) 32(AIN10) 33(AIN11) 34(AIN12) 35(AIN13) 36(AIN14) 37(AIN15) 38(GPO3) 39(REF-) 41(EP); IC6#2 4(A3) 5(A4) 6(A5) 7(A6) 8(A7) 9(A8) 12(B8) 13(B7) 14(B6) 15(B5) 16(B4) 17(B3); J2#2 1(Pin_1) 2(Pin_2) 3(Pin_3) 4(Pin_4) 5(Pin_5)

### Notes on the sheet
- (near C12#2) analog range: 0-5 V
  hall fx range: 0-5 V
  sg+ - sg -: 0-10 mV
- (near IC6#2) bidirectional level shifter (SPI)
- (near J2#2) sensor input and output
- V_out = G (sg+ - sg _) + V_ref
- G = 1 + (49.4 * 10^3) /R_g
- (near IC5#2) strain gauge1 input
- (near C30) IOVDD
- G (0.01) + 2.5 = 5
  Approximating w/ R_g = 200
- (near IC8#2) strain gauge2 input
- (near IC9#2) strain gauge3 input
- 1
- 2
- 3
- 4
- 5
- 6
- A
- B
- C
- D
- Title:
- File: untitled.kicad_sch
- Sheet: /
- KiCad E.D.A.  kicad (5.1.4)-1
- Size: A4
- Date:
- Rev:
- Id: 1/1

### Library data of the parts
C12#2 C13#2 C14#2 C17#2 C18#2 C19#2 C20#2 C21#2 C22#2 C23#2 C24#2 C25#2 C26#2 C27#2 C28-C30 = C
  C12#2 C17#2 C22#2 C24#2 C27#2: Value: 0.1U
  C13#2 C14#2 C18#2 C19#2 C20#2 C21#2 C25#2 C28: Value: 1u
  C23#2: Value: 4.7u
  C26#2 C29 C30: Value: 0.1u
IC4#2 = AD7175-8BCPZ-RL7: Manufacturer_Name: Analog Devices; Height: 0.8; Mouser Part Number: 584-AD7175-8BCPZ-RL7; Mouser Price/Stock: https://www.mouser.co.uk/ProductDetail/Analog-Devices/AD7175-8BCPZ-RL7?qs=JeIcUl65ClCxXjl02vXI6Q%3D%3D; Manufacturer_Part_Number: AD7175-8BCPZ-RL7; Value: AD7175-8BCPZ-RL7
IC5#2 IC8#2 IC9#2 = INA821IDGKT: Manufacturer_Name: Texas Instruments; Height: 1.1; Mouser Part Number: 595-INA821IDGKT; Mouser Price/Stock: https://www.mouser.co.uk/ProductDetail/Texas-Instruments/INA821IDGKT?qs=LDGDZb5k%2F%252B8diOW5CeiHfQ%3D%3D; Manufacturer_Part_Number: INA821IDGKT; Value: INA821IDGKT
IC6#2 = TXB0108PWR: Manufacturer_Name: Texas Instruments; Height: 1.2; Mouser Part Number: 595-TXB0108PWR; Mouser Price/Stock: https://www.mouser.co.uk/ProductDetail/Texas-Instruments/TXB0108PWR?qs=oFXvjAmG9EgEUWGWzOVFCA%3D%3D; Manufacturer_Part_Number: TXB0108PWR; Value: TXB0108PWR
R1#2 R4#2 R6#2 = R: Value: 200
J2#2 = Conn_01x25: Value: Conn_01x25
R2#2 R3#2 R5#2 = R: Value: R

## Nets that join several sheets
GND: accessoryidk (27 pins), teensy (17 pins), sensor_input (24 pins), AD7175-8 (16 pins), untitled (20 pins)
2.5v: accessoryidk (C3.2 D6.1 TP5.1), sensor_input (J2#1.33 J6.2), untitled (J2#2.25)
2.5v_ref: accessoryidk (C11.1 D4.1 TP3.1), sensor_input (IC4#1.6 IC5#1.6 IC8#1.6)
3V3: teensy (D8.1 TP1.1), sensor_input (C12#1.1 IC6#1.2 IC6#1.10), AD7175-8 (C37.1 C38.1 IC9#1.20 R7.1)
5v_buck: accessoryidk (9 pins), teensy (C22#1.2 C23#1.2 U1.VIN), sensor_input (J2#1.17 J8.1), AD7175-8 (C31.1 C32.1 IC9#1.9 IC9#1.10), untitled (C27#2.1 IC4#2.9 IC4#2.10)
5v_ref: accessoryidk (C15.1 D5.1 TP4.1), sensor_input (C17#1.1 IC6#1.19), AD7175-8 (C35.1 C36.1 IC9#1.40)
5v_reful: accessoryidk (C8.2 D7.1 TP6.1), sensor_input (8 pins), untitled (7 pins)
12v: accessoryidk (10 pins), sensor_input (6 pins)
!CS: teensy (U1.10), AD7175-8 (IC9#1.17)
!ERROR: teensy (U1.15), AD7175-8 (IC9#1.18 R7.2)
brakespeed1: sensor_input (J2#1.25 J4.6), AD7175-8 (IC9#1.29)
brakespeed2: sensor_input (J2#1.7 J3.1), AD7175-8 (IC9#1.28)
hallfx1_3v3: teensy (U1.16), sensor_input (IC6#1.1)
hallfx2_3v3: teensy (U1.17), sensor_input (IC6#1.3)
linpot1: sensor_input (J2#1.4 J4.1), AD7175-8 (IC9#1.34)
linpot2: sensor_input (J2#1.23 J4.2), AD7175-8 (IC9#1.33)
potentiometer: sensor_input (J2#1.6 J4.5), AD7175-8 (IC9#1.30)
Rx+: teensy (T1.16), sensor_input (J2#1.18 J5.1)
Rx-: teensy (T1.14), sensor_input (J2#1.36 J5.2)
SCLK: teensy (U1.13), AD7175-8 (IC9#1.16)
SDI: teensy (U1.11), AD7175-8 (IC9#1.15)
SDO: teensy (U1.12), AD7175-8 (IC9#1.14)
sg1: sensor_input (IC5#1.7), AD7175-8 (IC9#1.35), untitled (IC5#2.7)
sg1+: sensor_input (IC5#1.4 J2#1.1 J7.5), untitled (IC5#2.4 J2#2.23)
sg1-: sensor_input (IC5#1.1 J2#1.20 J7.6), untitled (IC5#2.1 J2#2.22)
sg2: sensor_input (IC8#1.7), AD7175-8 (IC9#1.36), untitled (IC8#2.7)
sg2+: sensor_input (IC8#1.4 J2#1.2 J7.3), untitled (IC8#2.4 J2#2.21)
sg2-: sensor_input (IC8#1.1 J2#1.21 J7.4), untitled (IC8#2.1 J2#2.20)
sg3: sensor_input (IC4#1.7), AD7175-8 (IC9#1.37), untitled (IC9#2.7)
sg3+: sensor_input (IC4#1.4 J2#1.3 J7.1), untitled (IC9#2.4 J2#2.19)
sg3-: sensor_input (IC4#1.1 J2#1.22 J7.2), untitled (IC9#2.1 J2#2.18)
Tx+: teensy (T1.11), sensor_input (J2#1.19 J5.3)
Tx-: teensy (T1.9), sensor_input (J2#1.37 J5.4)
usb_d+: teensy (U1.D+), sensor_input (J2#1.34 J8.2)
usb_d-: teensy (U1.D-), sensor_input (J2#1.16 J8.3)
wheelspeed1: sensor_input (J2#1.5 J4.3), AD7175-8 (IC9#1.32)
wheelspeed2: sensor_input (J2#1.24 J4.4), AD7175-8 (IC9#1.31)